# Altium schematic sheet REGENIX_Relais_24V_2.SchDoc
size Tabloid; Date: Date; Author: Author 1; DocumentNumber: 2; Revision: 1; SheetNumber: 15; SheetTotal: 17; Size: 11x17; Sheet_Name: BATTERY PROTECTION & AUXILIARY
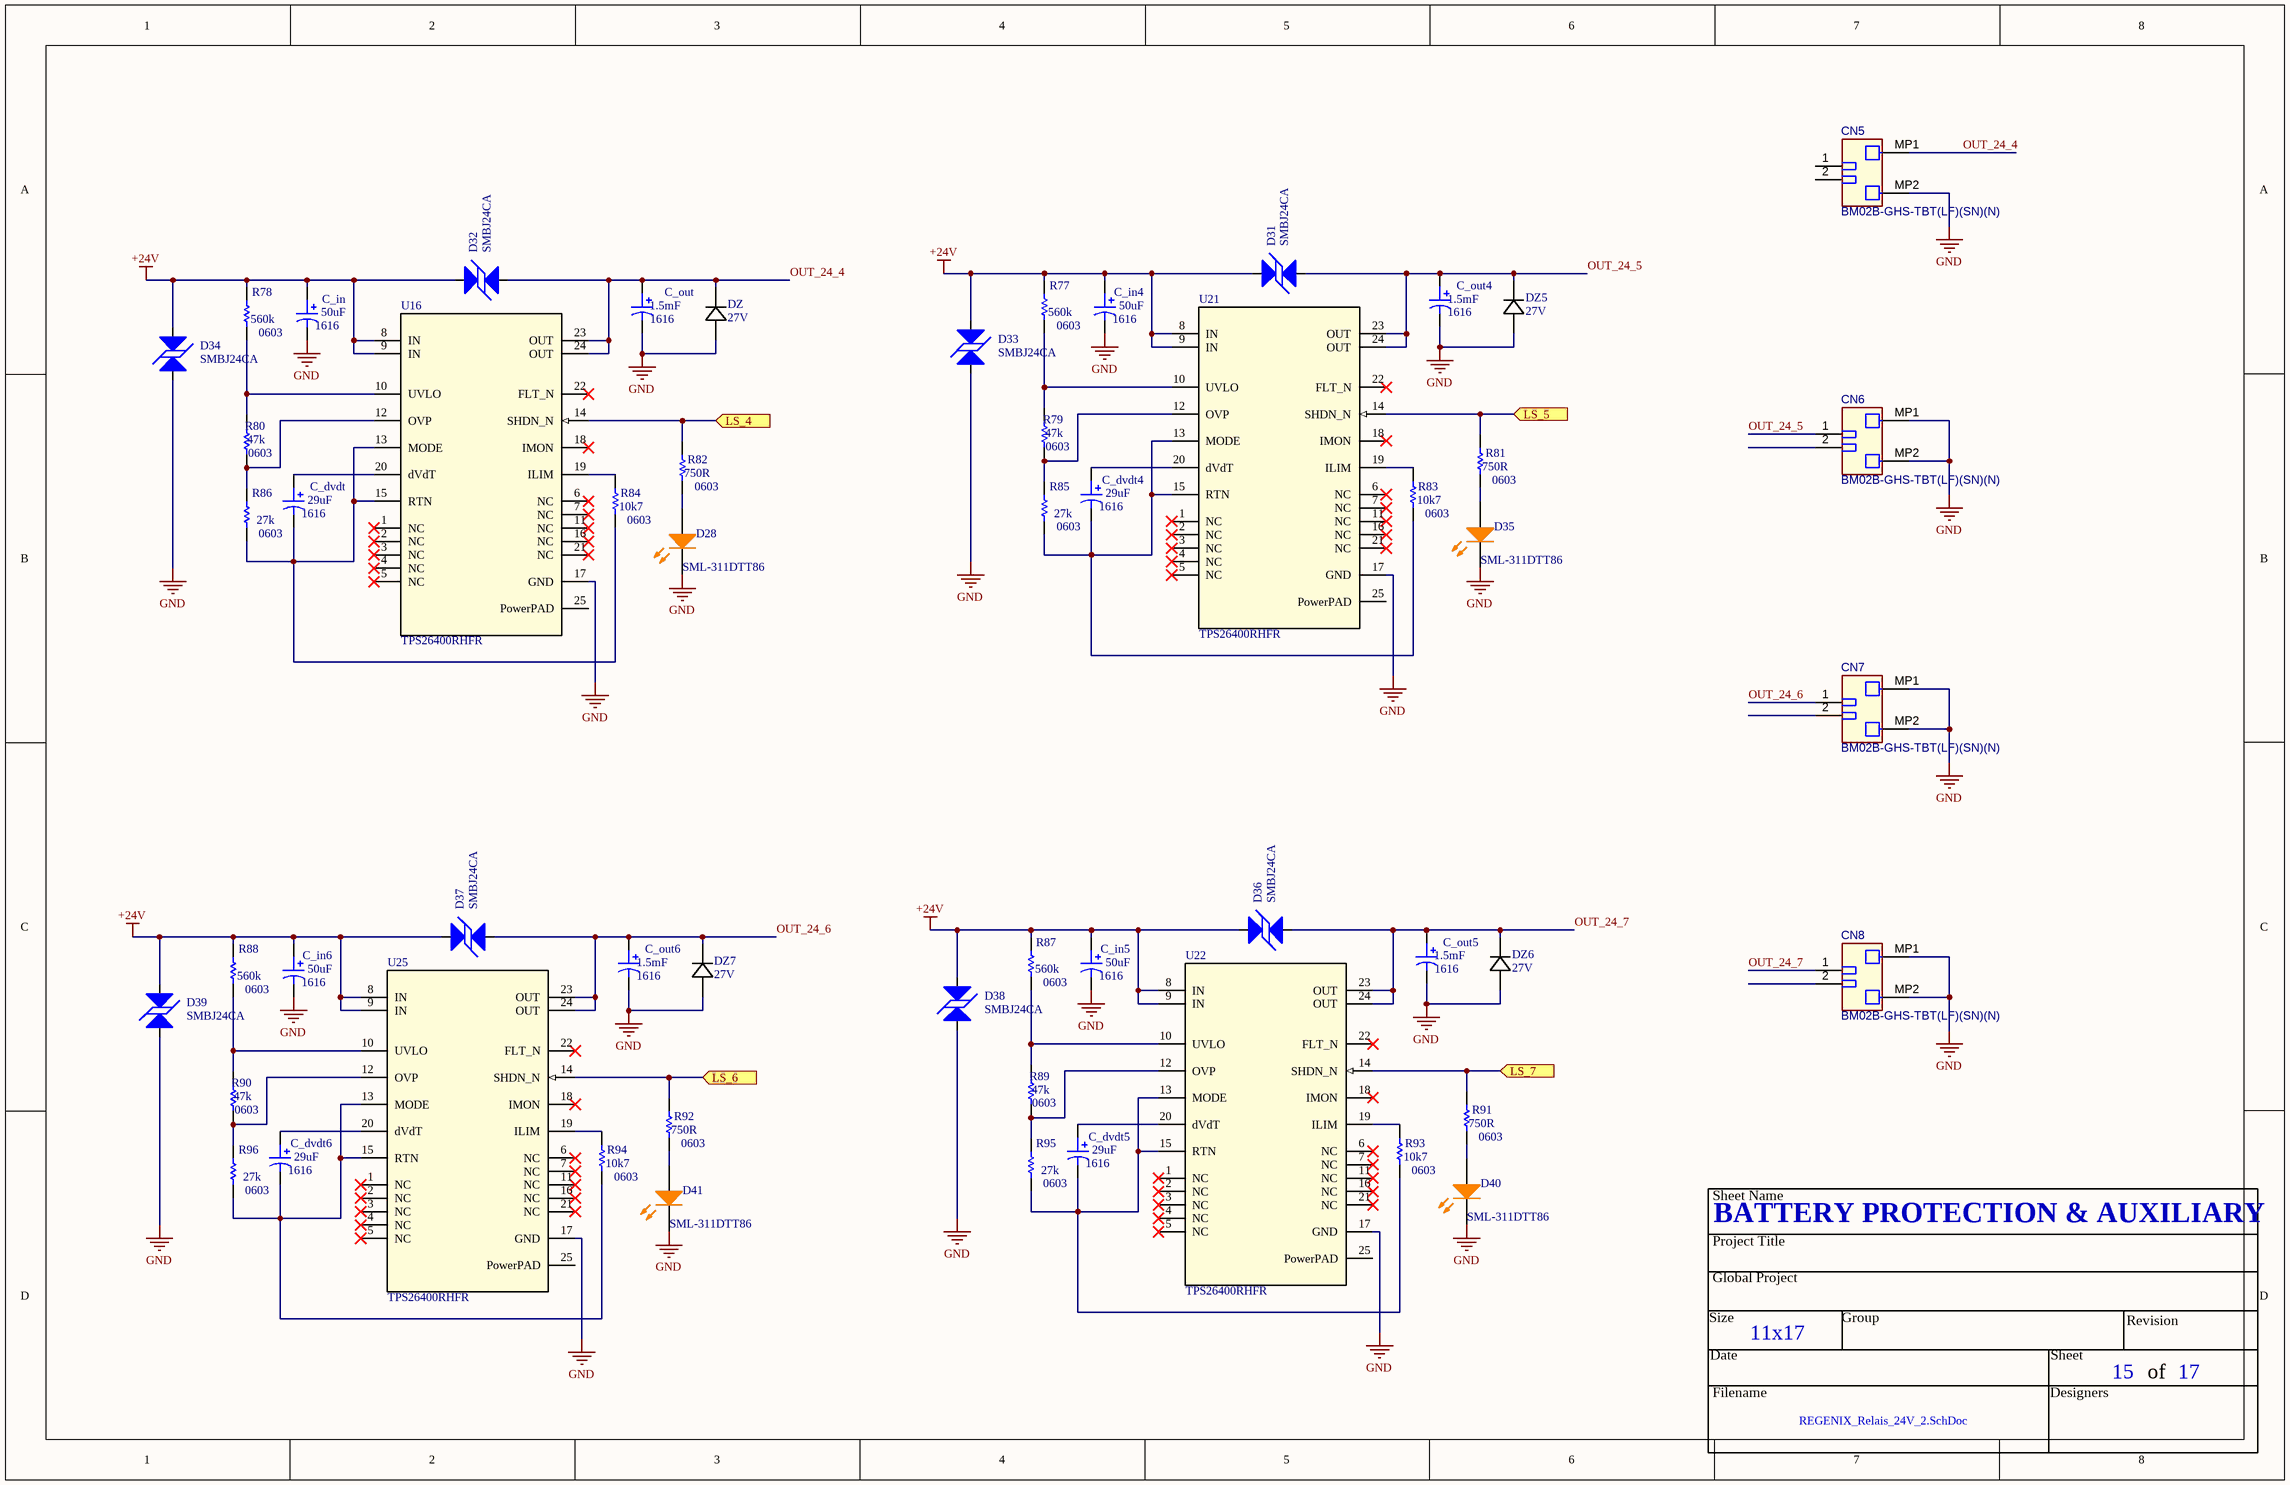
[diagram p0: REGENIX_Relais_24V_2.SchDoc]

## Parts
C_dvdt  value 29uF  Package: 1616  [CAP_ALU_1616_vishay]  (hidden comment: MAL214699108E3)
C_dvdt4  value 29uF  Package: 1616  [CAP_ALU_1616_vishay]  (hidden comment: MAL214699108E3)
C_dvdt5  value 29uF  Package: 1616  [CAP_ALU_1616_vishay]  (hidden comment: MAL214699108E3)
C_dvdt6  value 29uF  Package: 1616  [CAP_ALU_1616_vishay]  (hidden comment: MAL214699108E3)
C_in  value 50uF  Package: 1616  [CAP_ALU_1616_vishay]  (hidden comment: MAL214699108E3)
C_in4  value 50uF  Package: 1616  [CAP_ALU_1616_vishay]  (hidden comment: MAL214699108E3)
C_in5  value 50uF  Package: 1616  [CAP_ALU_1616_vishay]  (hidden comment: MAL214699108E3)
C_in6  value 50uF  Package: 1616  [CAP_ALU_1616_vishay]  (hidden comment: MAL214699108E3)
C_out  value 1.5mF  Package: 1616  [CAP_ALU_1616_vishay]  (hidden comment: MAL214699108E3)
C_out4  value 1.5mF  Package: 1616  [CAP_ALU_1616_vishay]  (hidden comment: MAL214699108E3)
C_out5  value 1.5mF  Package: 1616  [CAP_ALU_1616_vishay]  (hidden comment: MAL214699108E3)
C_out6  value 1.5mF  Package: 1616  [CAP_ALU_1616_vishay]  (hidden comment: MAL214699108E3)
CN5  BM02B-GHS-TBT(LF)(SN)(N)  [JST-BM02B-GHS-TBT_V]
CN6  BM02B-GHS-TBT(LF)(SN)(N)  [JST-BM02B-GHS-TBT_V]
CN7  BM02B-GHS-TBT(LF)(SN)(N)  [JST-BM02B-GHS-TBT_V]
CN8  BM02B-GHS-TBT(LF)(SN)(N)  [JST-BM02B-GHS-TBT_V]
D28  SML-311DTT86  [LED_0603]
D31  SMBJ24CA  [TVS_PWR_SMBJ36CA]
D32  SMBJ24CA  [TVS_PWR_SMBJ36CA]
D33  SMBJ24CA  [TVS_PWR_SMBJ36CA]
D34  SMBJ24CA  [TVS_PWR_SMBJ36CA]
D35  SML-311DTT86  [LED_0603]
D36  SMBJ24CA  [TVS_PWR_SMBJ36CA]
D37  SMBJ24CA  [TVS_PWR_SMBJ36CA]
D38  SMBJ24CA  [TVS_PWR_SMBJ36CA]
D39  SMBJ24CA  [TVS_PWR_SMBJ36CA]
D40  SML-311DTT86  [LED_0603]
D41  SML-311DTT86  [LED_0603]
DZ  27V  [SOD123_DIO]
DZ5  27V  [SOD123_DIO]
DZ6  27V  [SOD123_DIO]
DZ7  27V  [SOD123_DIO]
R77  Package: 0603  Precision: 560k  [RES_0603]  (hidden comment: RES - 0603)
R78  Package: 0603  Precision: 560k  [RES_0603]  (hidden comment: RES - 0603)
R79  Package: 0603  Precision: 47k  [RES_0603]  (hidden comment: RES - 0603)
R80  Package: 0603  Precision: 47k  [RES_0603]  (hidden comment: RES - 0603)
R81  Package: 0603  Precision: 750R  [RES_0603]  (hidden comment: RES - 0603)
R82  Package: 0603  Precision: 750R  [RES_0603]  (hidden comment: RES - 0603)
R83  Package: 0603  Precision: 10k7  [RES_0603]  (hidden comment: RES - 0603)
R84  Package: 0603  Precision: 10k7  [RES_0603]  (hidden comment: RES - 0603)
R85  Package: 0603  Precision: 27k  [RES_0603]  (hidden comment: RES - 0603)
R86  Package: 0603  Precision: 27k  [RES_0603]  (hidden comment: RES - 0603)
R87  Package: 0603  Precision: 560k  [RES_0603]  (hidden comment: RES - 0603)
R88  Package: 0603  Precision: 560k  [RES_0603]  (hidden comment: RES - 0603)
R89  Package: 0603  Precision: 47k  [RES_0603]  (hidden comment: RES - 0603)
R90  Package: 0603  Precision: 47k  [RES_0603]  (hidden comment: RES - 0603)
R91  Package: 0603  Precision: 750R  [RES_0603]  (hidden comment: RES - 0603)
R92  Package: 0603  Precision: 750R  [RES_0603]  (hidden comment: RES - 0603)
R93  Package: 0603  Precision: 10k7  [RES_0603]  (hidden comment: RES - 0603)
R94  Package: 0603  Precision: 10k7  [RES_0603]  (hidden comment: RES - 0603)
R95  Package: 0603  Precision: 27k  [RES_0603]  (hidden comment: RES - 0603)
R96  Package: 0603  Precision: 27k  [RES_0603]  (hidden comment: RES - 0603)
U16  TPS26400RHFR  [RHF0024A-IPC_A]
U21  TPS26400RHFR  [RHF0024A-IPC_A]
U22  TPS26400RHFR  [RHF0024A-IPC_A]
U25  TPS26400RHFR  [RHF0024A-IPC_A]

## Ports
LS_4 (in), LS_5 (in), LS_6 (in), LS_7 (in)

## Nets
+24V: C_in.1 C_in4.1 C_in5.1 C_in6.1 D31.1 D32.1 D33.1 D34.1 D36.1 D37.1 D38.1 D39.1 R77.2 R78.2 R87.2 R88.2 U16.8(IN) U16.9(IN) U21.8(IN) U21.9(IN) U22.8(IN) U22.9(IN) U25.8(IN) U25.9(IN)
GND: C_in.2 C_in4.2 C_in5.2 C_in6.2 C_out.2 C_out4.2 C_out5.2 C_out6.2 CN5.MP2 CN6.MP1 CN6.MP2 CN7.MP1 CN7.MP2 CN8.MP1 CN8.MP2 D28.K D33.2 D34.2 D35.K D38.2 D39.2 D40.K D41.K DZ.2 DZ5.2 DZ6.2 DZ7.2 U16.17(GND) U21.17(GND) U22.17(GND) U25.17(GND)
LS_4: R82.2 U16.14(SHDN_N) ; port LS_4
LS_5: R81.2 U21.14(SHDN_N) ; port LS_5
LS_6: R92.2 U25.14(SHDN_N) ; port LS_6
LS_7: R91.2 U22.14(SHDN_N) ; port LS_7
OUT_24_4: C_out.1 CN5.MP1 D32.2 DZ.1 U16.23(OUT) U16.24(OUT)
OUT_24_5: C_out4.1 CN6.1 D31.2 DZ5.1 U21.23(OUT) U21.24(OUT)
OUT_24_6: C_out6.1 CN7.1 D37.2 DZ7.1 U25.23(OUT) U25.24(OUT)
OUT_24_7: C_out5.1 CN8.1 D36.2 DZ6.1 U22.23(OUT) U22.24(OUT)
NetC_dvdt4_1: C_dvdt4.1 U21.20(dVdT)
NetC_dvdt4_2: C_dvdt4.2 R83.1 R85.1 U21.13(MODE) U21.15(RTN)
NetC_dvdt5_1: C_dvdt5.1 U22.20(dVdT)
NetC_dvdt5_2: C_dvdt5.2 R93.1 R95.1 U22.13(MODE) U22.15(RTN)
NetC_dvdt6_1: C_dvdt6.1 U25.20(dVdT)
NetC_dvdt6_2: C_dvdt6.2 R94.1 R96.1 U25.13(MODE) U25.15(RTN)
NetC_dvdt_1: C_dvdt.1 U16.20(dVdT)
NetC_dvdt_2: C_dvdt.2 R84.1 R86.1 U16.13(MODE) U16.15(RTN)
NetD28_A: D28.A R82.1
NetD35_A: D35.A R81.1
NetD40_A: D40.A R91.1
NetD41_A: D41.A R92.1
NetR77_1: R77.1 R79.2 U21.10(UVLO)
NetR78_1: R78.1 R80.2 U16.10(UVLO)
NetR79_1: R79.1 R85.2 U21.12(OVP)
NetR80_1: R80.1 R86.2 U16.12(OVP)
NetR83_2: R83.2 U21.19(ILIM)
NetR84_2: R84.2 U16.19(ILIM)
NetR87_1: R87.1 R89.2 U22.10(UVLO)
NetR88_1: R88.1 R90.2 U25.10(UVLO)
NetR89_1: R89.1 R95.2 U22.12(OVP)
NetR90_1: R90.1 R96.2 U25.12(OVP)
NetR93_2: R93.2 U22.19(ILIM)
NetR94_2: R94.2 U25.19(ILIM)

Not connected (* = marked no-connect by the designer): CN5 1 2; CN6 2; CN7 2; CN8 2; U16 1(NC)* 2(NC)* 3(NC)* 4(NC)* 5(NC)* 6(NC)* 7(NC)* 11(NC)* 16(NC)* 18(IMON)* 21(NC)* 22(FLT_N)* 25(PowerPAD); U21 1(NC)* 2(NC)* 3(NC)* 4(NC)* 5(NC)* 6(NC)* 7(NC)* 11(NC)* 16(NC)* 18(IMON)* 21(NC)* 22(FLT_N)* 25(PowerPAD); U22 1(NC)* 2(NC)* 3(NC)* 4(NC)* 5(NC)* 6(NC)* 7(NC)* 11(NC)* 16(NC)* 18(IMON)* 21(NC)* 22(FLT_N)* 25(PowerPAD); U25 1(NC)* 2(NC)* 3(NC)* 4(NC)* 5(NC)* 6(NC)* 7(NC)* 11(NC)* 16(NC)* 18(IMON)* 21(NC)* 22(FLT_N)* 25(PowerPAD)

## Notes on the sheet
- Sheet Name
- Project Title
- Global Project
- Revision
- Size
- Date
- Group
- Sheet
- of
- Filename
- Designers

## Library data of the parts
C_dvdt C_dvdt4-C_dvdt6 C_in C_in4-C_in6 C_out C_out4-C_out6 = CAP_ALU_MAL214699108E3: CAP - ALU 470uF 20% 50V - 1616; Current: 1.3A; Mfg: Vishay Dale; Mfg Part Number: MAL214699108E3; HelpURL: http://www.vishay.com/docs/28403/146cti.pdf; CreatedBy: Jonathan Bouchard; Temperature: -55°C to 125°C; Power: *; Supplier 1: Digikey; Supplier Part Number 1: 4442PHCT-ND
CN5-CN8 = CMP-002-00061-3: Disconnectable Crimp Style Connector, Pitch 1.25 mm, 1 x 2 Position, Height 4.05 mm, -25 to 85 degC, RoHS, Tape and Reel; Connector Type: Header,Shrouded; Mounting Technology: SurfaceMount; Case/Package: Disconnectable Crimp Style Connector, Pitch 1.25 mm, 1 x 2 Position, Height 4.05 mm; Pins: 4
D28 D35 D40 D41 = LED_SML-311DTT86: LED - 611nM ORANGE 2mA - 0603; Voltage: 1.8V; Mfg: ROHM Semiconductor; Power: 44mW; Current: 2mA; HelpURL: http://media.digikey.com/pdf/Data%20Sheets/Rohm%20PDFs/SML-311%20Series.pdf; CreatedBy: Jonathan Bouchard; Temperature: -40°C to 85°C; Package: 0603; Precision: *; Mfg Part Number: SML-311DTT86; Supplier 1: Digikey; Supplier Part Number 1: 511-1303-1-ND
D31-D34 D36-D39 = TVS_PWR_SMBJ24CA: TVS - 24V 26.7V 600W - DO214AA; Manufacturer #1: Littelfuse Inc.; Value: Vbr = 26.7V -  Clamp = 38.9V; Voltage Rating: 24V Standoff; Current Rating: 15.5A; GRAMS Lib Spec: 2.8; Magnetic Material: UNKNOWN; Polarized: NO; Tolerance: *; Power Max: 600W; HelpURL: http://www.littelfuse.com/~/media/electronics/datasheets/tvs_diodes/littelfuse_tvs_diode_smbj_datasheet.pdf.pdf; CreatedBy/Date: Arnaud Samson - 06/07/18; VerifiedBy: Jonathan Bouchard - 2018-07-13; Temperature: -65°C ~ 150°C (TJ); Package: DO214AA; Manufacturer #2: *; Note: *; Assembly Type: SMD; Part Number #2: *; Part Number #1: SMBJ24CA; Supplier 1: Digi-Key; Supplier Part Number 1: SMBJ24CALFCT-ND; Cryo: UNKNOWN
DZ DZ5-DZ7 = MMSZ5254B-7-F: DIODE ZENER 27V 500MW SOD123 MMSZ5254B-7-F; Mfr_Name: Diodes Inc
U16 U21 U22 U25 = TPS26400RHFR: No Description Available; Mfr_Name: Texas Instruments; TYPE: TYPE; RefDes: RefDes
R77-R96 = RES - 0603: Current: *; CreatedBy: Jonathan Bouchard